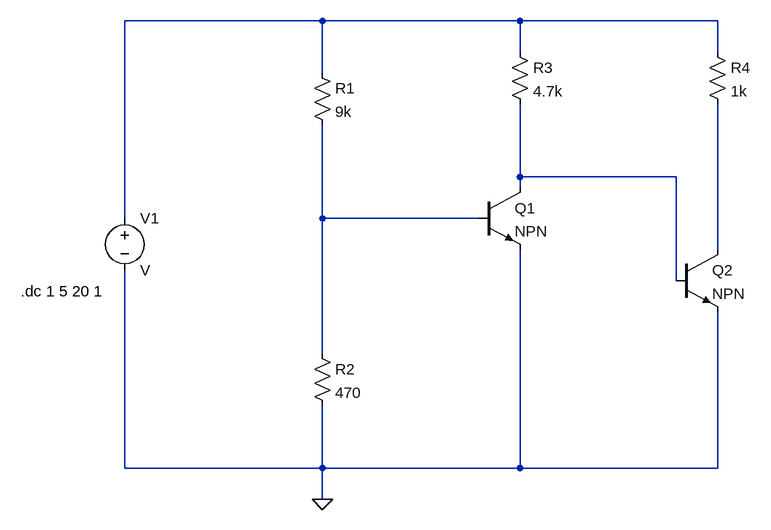
[diagram p0: schematic bjt npn.asc]
bjt npn.asc, the LTspice schematic file:
Version 4
SHEET 1 880 680
WIRE -80 -176 -384 -176
WIRE 224 -176 -80 -176
WIRE 528 -176 224 -176
WIRE 224 -128 224 -176
WIRE 528 -128 528 -176
WIRE -80 -96 -80 -176
WIRE 224 64 224 -48
WIRE 464 64 224 64
WIRE 224 80 224 64
WIRE -384 128 -384 -176
WIRE -80 128 -80 -16
WIRE 160 128 -80 128
WIRE 528 176 528 -48
WIRE 464 224 464 64
WIRE -80 336 -80 128
WIRE -384 512 -384 208
WIRE -80 512 -80 416
WIRE -80 512 -384 512
WIRE 224 512 224 176
WIRE 224 512 -80 512
WIRE 528 512 528 272
WIRE 528 512 224 512
WIRE -80 560 -80 512
FLAG -80 560 0
SYMBOL npn 160 80 R0
SYMATTR InstName Q1
SYMBOL voltage -384 112 R0
SYMATTR InstName V1
SYMBOL res -96 -112 R0
SYMATTR InstName R1
SYMATTR Value 9k
SYMATTR SpiceLine tol=1 pwr=0.1
SYMBOL res -96 320 R0
SYMATTR InstName R2
SYMATTR Value 470
SYMBOL res 208 -144 R0
SYMATTR InstName R3
SYMATTR Value 4.7k
SYMBOL res 512 -144 R0
SYMATTR InstName R4
SYMATTR Value 1k
SYMBOL npn 464 176 R0
SYMATTR InstName Q2
TEXT -544 240 Left 2 !.dc 1 5 20 1

The netlist it stands for:
* bjt npn.asc
Q1 N002 N003 0 0 NPN
V1 N001 0 V
R1 N001 N003 9k tol=1 pwr=0.1
R2 N003 0 470
R3 N001 N002 4.7k
R4 N001 N004 1k
Q2 N004 N002 0 0 NPN
.model NPN NPN
.model PNP PNP
.lib standard.bjt
.dc 1 5 20 1
.backanno
.end